# EAGLE schematic board_full (EAGLE 6.3)
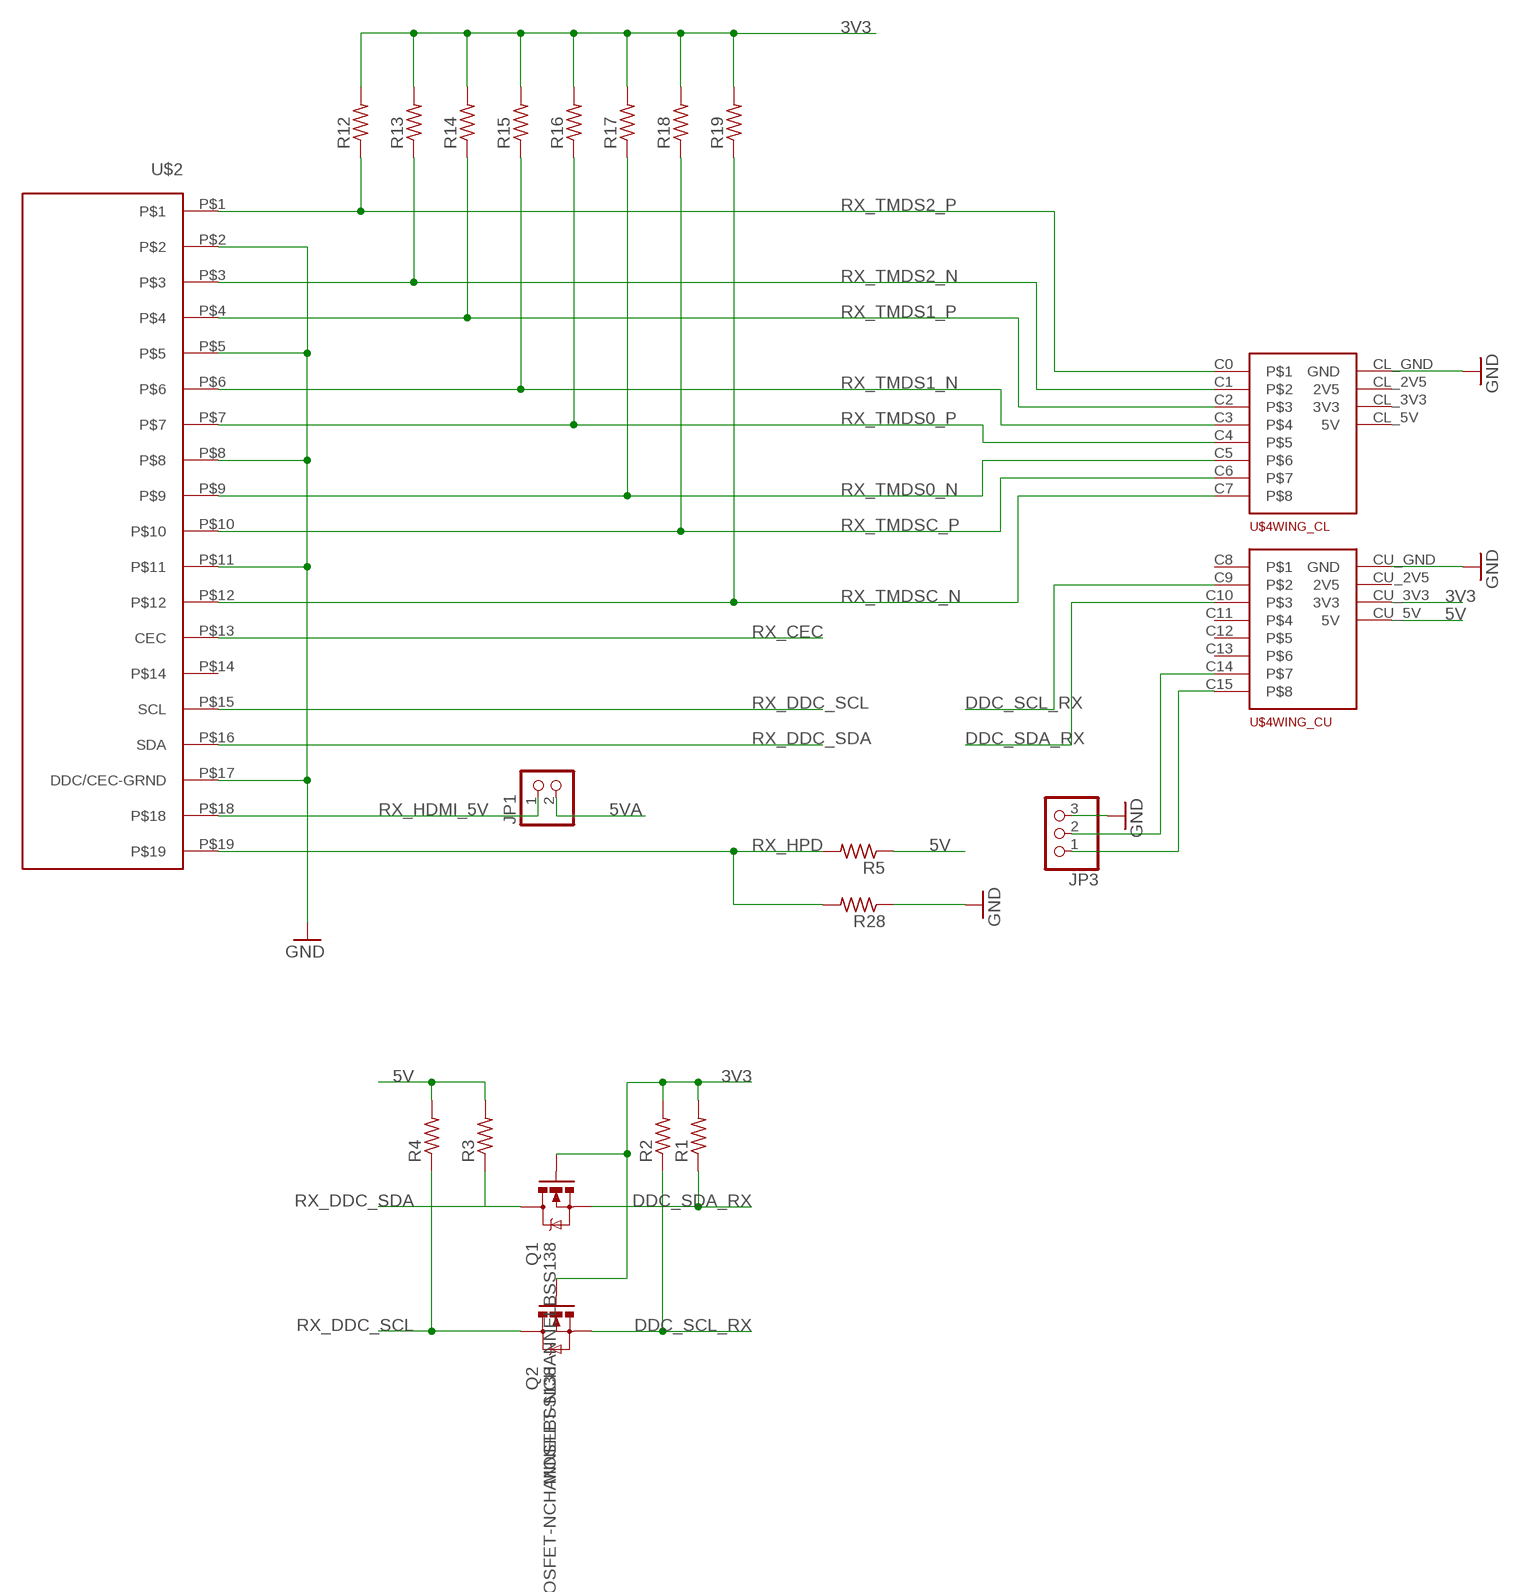
[diagram p0: schematic, sheet 1, part 1 of 2]
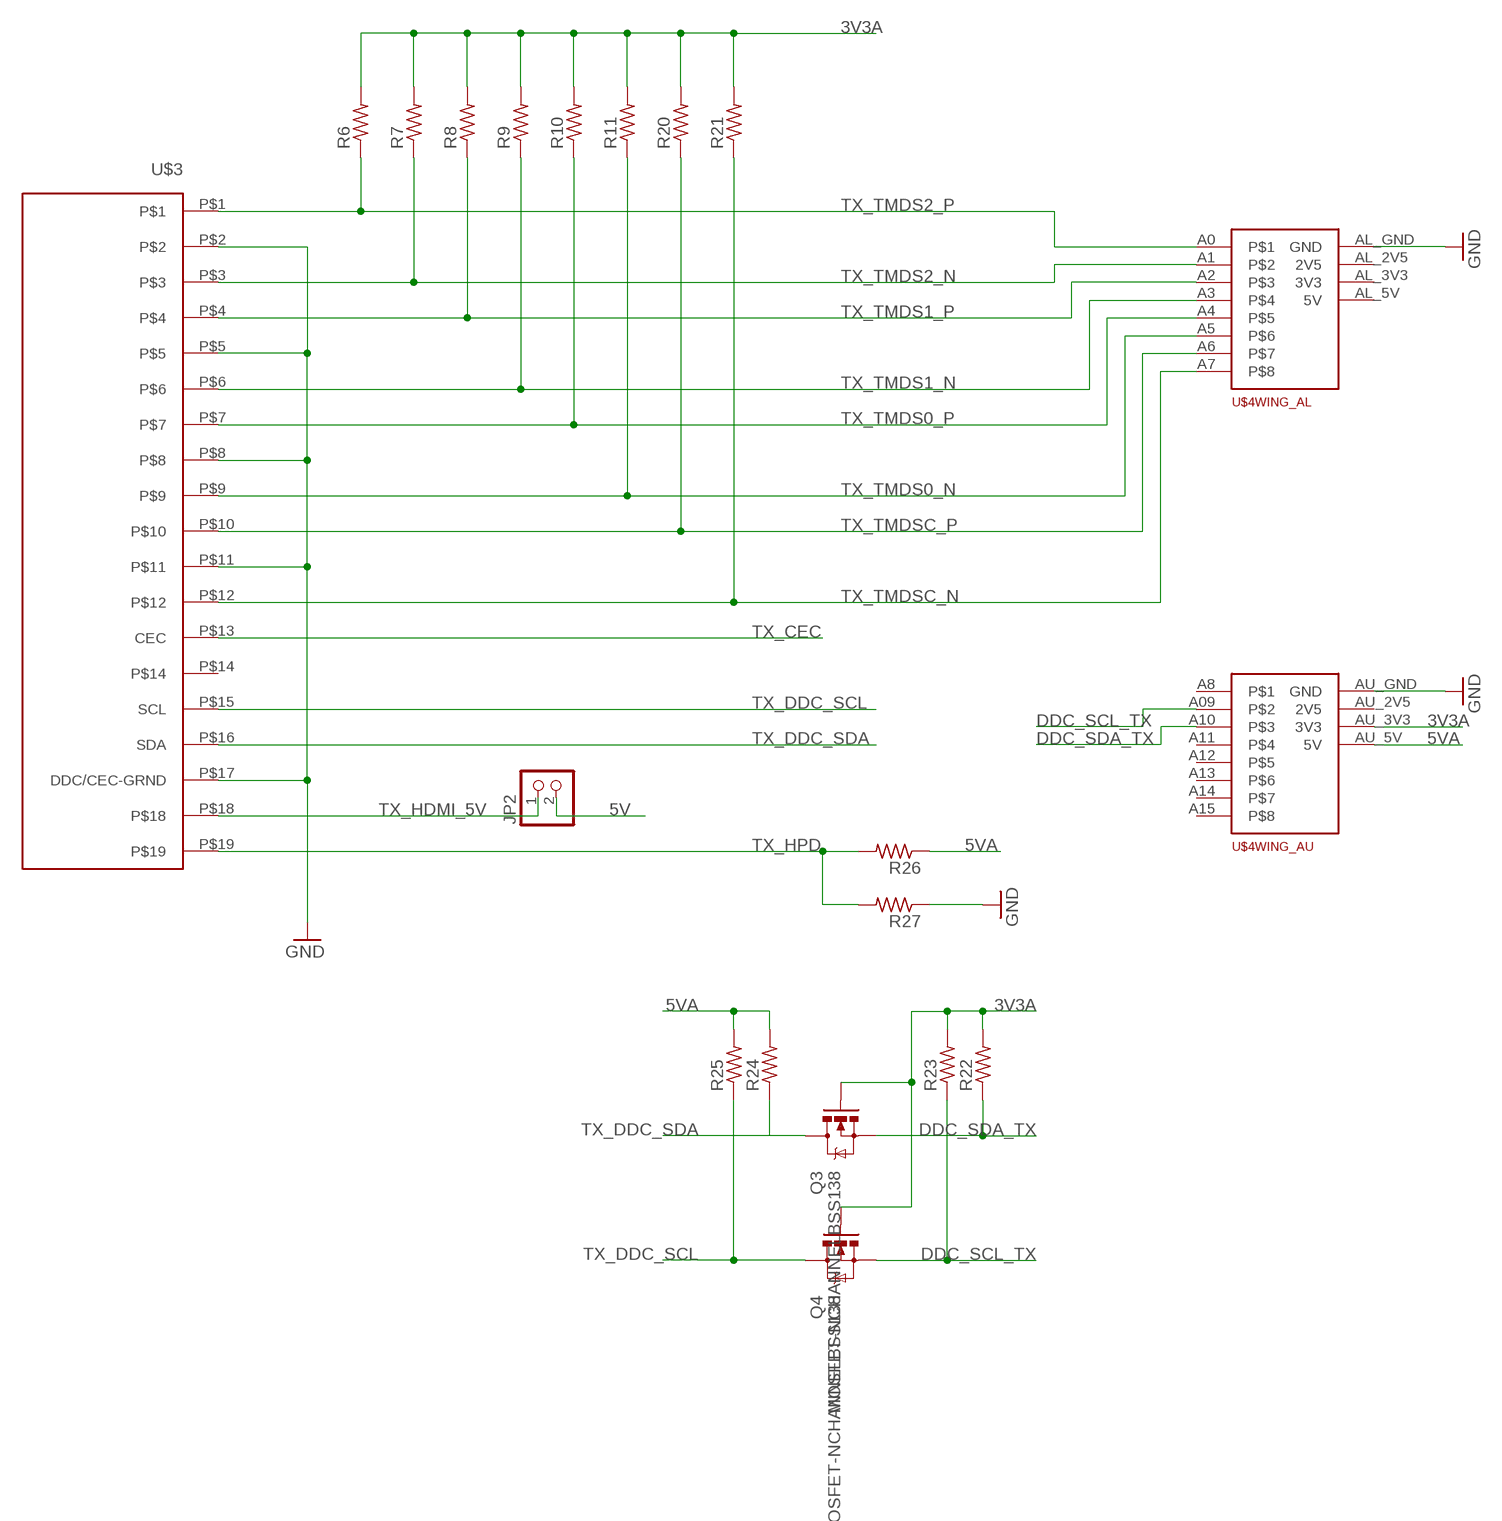
[diagram p1: schematic, sheet 1, part 2 of 2]

## Parts
JP1  PINHD-1X2  [1X02]
JP2  PINHD-1X2  [1X02]
JP3  PINHD-1X3  [1X03]
Q1  MOSFET-NCHANNELBSS138  [SOT23]
Q2  MOSFET-NCHANNELBSS138  [SOT23]
Q3  MOSFET-NCHANNELBSS138  [SOT23]
Q4  MOSFET-NCHANNELBSS138  [SOT23]
R1  R-US_R0805  [R0805]
R2  R-US_R0805  [R0805]
R3  R-US_R0805  [R0805]
R4  R-US_R0805  [R0805]
R5  R-US_R0805  [R0805]
R6  R-US_R0805  [R0805]
R7  R-US_R0805  [R0805]
R8  R-US_R0805  [R0805]
R9  R-US_R0805  [R0805]
R10  R-US_R0805  [R0805]
R11  R-US_R0805  [R0805]
R12  R-US_R0805  [R0805]
R13  R-US_R0805  [R0805]
R14  R-US_R0805  [R0805]
R15  R-US_R0805  [R0805]
R16  R-US_R0805  [R0805]
R17  R-US_R0805  [R0805]
R18  R-US_R0805  [R0805]
R19  R-US_R0805  [R0805]
R20  R-US_R0805  [R0805]
R21  R-US_R0805  [R0805]
R22  R-US_R0805  [R0805]
R23  R-US_R0805  [R0805]
R24  R-US_R0805  [R0805]
R25  R-US_R0805  [R0805]
R26  R-US_R0805  [R0805]
R27  R-US_R0805  [R0805]
R28  R-US_R0805  [R0805]
U$2  HDMI-TYPE-A-RECEPTICALFCI10029449  [FCI-HDMI-TYPE-A-RECEPT]
U$3  HDMI-TYPE-A-RECEPTICALFCI10029449  [FCI-HDMI-TYPE-A-RECEPT]
U$4  PAPILIO48  [PAPILIO48]

## Nets
3V3: Q1.1(G) Q2.1(G) R1.2 R2.2 R12.2 R13.2 R14.2 R15.2 R16.2 R17.2 R18.2 R19.2 U$4.CU_3V3(WING_CU:3V3)
3V3A: Q3.1(G) Q4.1(G) R6.2 R7.2 R8.2 R9.2 R10.2 R11.2 R20.2 R21.2 R22.2 R23.2 U$4.AU_3V3(WING_AU:3V3)
5V: JP2.2 R3.2 R4.2 R5.1 U$4.CU_5V(WING_CU:5V)
5VA: JP1.2 R24.2 R25.2 R26.1 U$4.AU_5V(WING_AU:5V)
DDC_SCL_RX: Q2.2(S) R2.1 U$4.C9
DDC_SCL_TX: Q4.2(S) R23.1 U$4.A09
DDC_SDA_RX: Q1.2(S) R1.1 U$4.C10
DDC_SDA_TX: Q3.2(S) R22.1 U$4.A10
GND: JP3.3 R27.1 R28.1 U$2.P$2 U$2.P$5 U$2.P$8 U$2.P$11 U$2.P$17(DDC/CEC-GRND) U$3.P$2 U$3.P$5 U$3.P$8 U$3.P$11 U$3.P$17(DDC/CEC-GRND) U$4.AL_GND(WING_AL:GND) U$4.AU_GND(WING_AU:GND) U$4.CL_GND(WING_CL:GND) U$4.CU_GND(WING_CU:GND)
N$1: JP3.2 U$4.C14
N$2: JP3.1 U$4.C15
RX_CEC: U$2.P$13(CEC)
RX_DDC_SCL: Q2.3(D) R4.1 U$2.P$15(SCL)
RX_DDC_SDA: Q1.3(D) R3.1 U$2.P$16(SDA)
RX_HDMI_5V: JP1.1 U$2.P$18
RX_HPD: R5.2 R28.2 U$2.P$19
RX_TMDS0_N: R17.1 U$2.P$9 U$4.C5
RX_TMDS0_P: R16.1 U$2.P$7 U$4.C4
RX_TMDS1_N: R15.1 U$2.P$6 U$4.C3
RX_TMDS1_P: R14.1 U$2.P$4 U$4.C2
RX_TMDS2_N: R13.1 U$2.P$3 U$4.C1
RX_TMDS2_P: R12.1 U$2.P$1 U$4.C0
RX_TMDSC_N: R19.1 U$2.P$12 U$4.C7
RX_TMDSC_P: R18.1 U$2.P$10 U$4.C6
TX_CEC: U$3.P$13(CEC)
TX_DDC_SCL: Q4.3(D) R25.1 U$3.P$15(SCL)
TX_DDC_SDA: Q3.3(D) R24.1 U$3.P$16(SDA)
TX_HDMI_5V: JP2.1 U$3.P$18
TX_HPD: R26.2 R27.2 U$3.P$19
TX_TMDS0_N: R11.1 U$3.P$9 U$4.A5
TX_TMDS0_P: R10.1 U$3.P$7 U$4.A4
TX_TMDS1_N: R9.1 U$3.P$6 U$4.A3
TX_TMDS1_P: R8.1 U$3.P$4 U$4.A2
TX_TMDS2_N: R7.1 U$3.P$3 U$4.A1
TX_TMDS2_P: R6.1 U$3.P$1 U$4.A0
TX_TMDSC_N: R21.1 U$3.P$12 U$4.A7
TX_TMDSC_P: R20.1 U$3.P$10 U$4.A6
Unconnected: U$2.P$14 U$3.P$14 U$4.A8 U$4.A11 U$4.A12 U$4.A13 U$4.A14 U$4.A15 U$4.AL_2V5(WING_AL:2V5) U$4.AL_3V3(WING_AL:3V3) U$4.AL_5V(WING_AL:5V) U$4.AU_2V5(WING_AU:2V5) U$4.C8 U$4.C11 U$4.C12 U$4.C13 U$4.CL_2V5(WING_CL:2V5) U$4.CL_3V3(WING_CL:3V3) U$4.CL_5V(WING_CL:5V) U$4.CU_2V5(WING_CU:2V5)

## Library data of the parts
JP1 JP2 = pinhead:PINHD-1X2: PIN HEADER
JP3 = pinhead:PINHD-1X3: PIN HEADER
Q1-Q4 = SparkFun-DiscreteSemi:MOSFET-NCHANNEL: Common NMOSFET Parts MFG P/N Store ID Prod ID FDD8780 TRANS-09984 SI7820DN TRANS-11055 FDS6630A IC-08089 2N7002PW TRANS-11151 FQP30N06L COM-10213 TRANS-10060 BSS123LT1G TRANS-08345 BSS138 TRANS-00830 BS170 2N7000; PROD_ID: TRANS-00830
R1-R28 = rcl:R-US_: RESISTOR, American symbol
U$2 U$3 = hdmi:HDMI-TYPE-A-RECEPTICAL
U$4 = papilio:PAPILIO48: Papilio One Full Wing, Created by AtomSoft.